# EAGLE design rev1 (EAGLE 6.5.0)
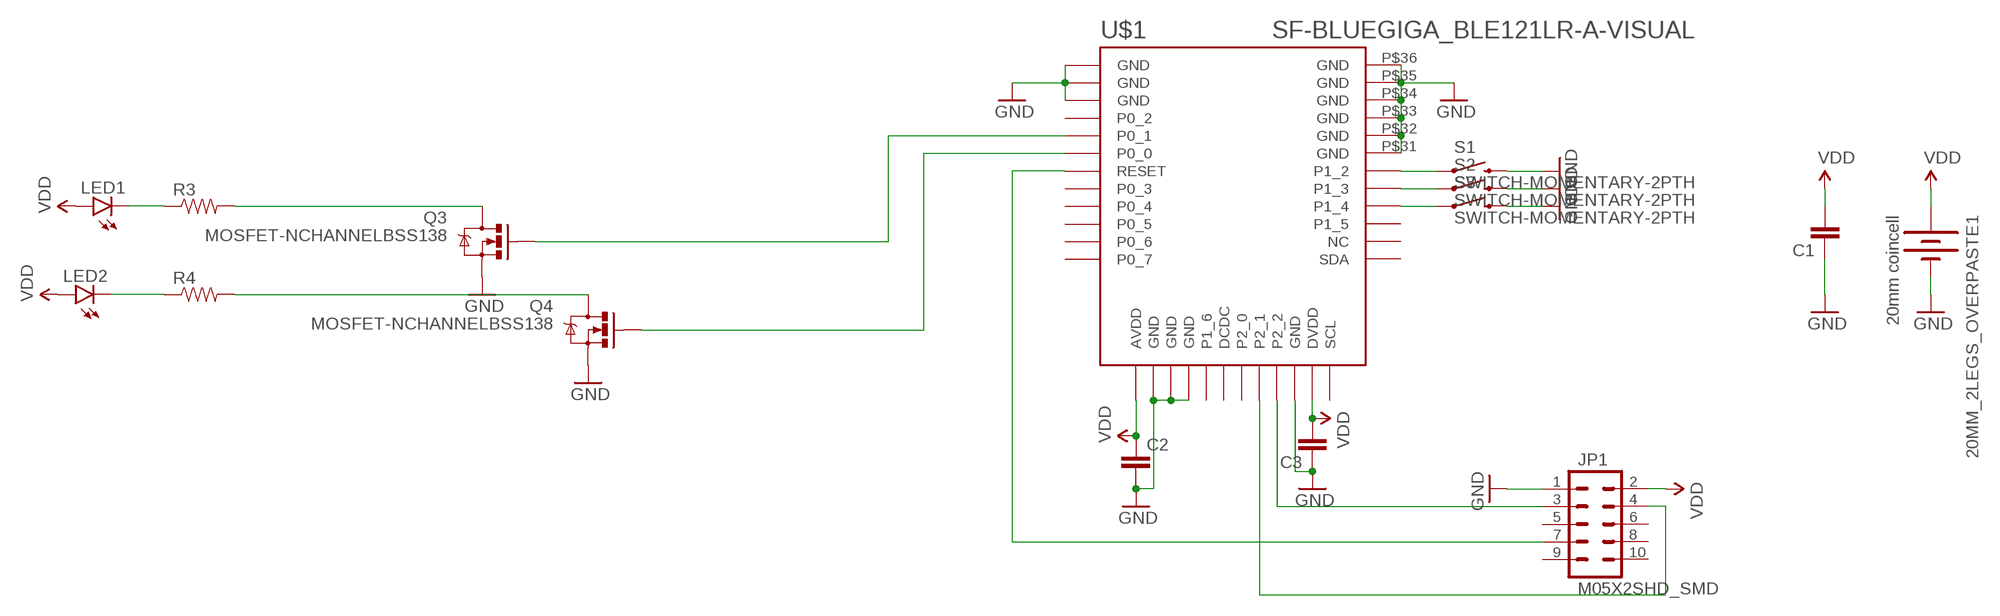
[diagram p0: schematic, sheet 1]

## Parts
20MM_2LEGS_OVERPASTE1  20mm coincell  BATTERY20MM_4LEGS  [BATTCON_20MM_4LEGS]
C1  CAP1206  [1206]
C2  CAP0603-CAP  [0603-CAP]
C3  CAP0603-CAP  [0603-CAP]
JP1  M05X2SHD_SMD  [2X5-SHROUDED_SMD]
LED1  LED1206  [LED-1206]
LED2  LED1206  [LED-1206]
Q3  MOSFET-NCHANNELBSS138  [SOT23-3]
Q4  MOSFET-NCHANNELBSS138  [SOT23-3]
R3  RESISTOR0603  [0603-RES]
R4  RESISTOR0603  [0603-RES]
S1  SWITCH-MOMENTARY-2PTH  [TACTILE-PTH]
S2  SWITCH-MOMENTARY-2PTH  [TACTILE-PTH]
S3  SWITCH-MOMENTARY-2PTH  [TACTILE-PTH]
U$1  SF-BLUEGIGA_BLE121LR-A-VISUAL  [SF-BLUEGIGA_BLE121LR-A]

## Nets
GND: 20MM_2LEGS_OVERPASTE1.2(-) C1.1 C2.2 C3.1 JP1.1 Q3.2(S) Q4.2(S) S1.3 S2.3 S3.3 U$1.P$1(GND) U$1.P$2(GND) U$1.P$3(GND) U$1.P$14(GND) U$1.P$15(GND) U$1.P$16(GND) U$1.P$22(GND) U$1.P$31(GND) U$1.P$32(GND) U$1.P$33(GND) U$1.P$34(GND) U$1.P$35(GND) U$1.P$36(GND)
N$1: Q4.1(G) U$1.P$6(P0_0)
N$3: S1.1 U$1.P$30(P1_2)
N$4: S2.1 U$1.P$29(P1_3)
N$5: S3.1 U$1.P$28(P1_4)
N$6: Q3.3(D) R3.2
N$7: Q4.3(D) R4.2
N$8: Q3.1(G) U$1.P$5(P0_1)
N$11: LED1.C R3.1
N$12: JP1.3 U$1.P$21(P2_2)
N$13: JP1.4 U$1.P$20(P2_1)
N$14: JP1.7 U$1.P$7(RESET)
N$15: LED2.C R4.1
VDD: 20MM_2LEGS_OVERPASTE1.1(+) C1.2 C2.1 C3.2 JP1.2 LED1.A LED2.A U$1.P$13(AVDD) U$1.P$23(DVDD)
Unconnected: JP1.5 JP1.6 JP1.8 JP1.9 JP1.10 U$1.P$4(P0_2) U$1.P$8(P0_3) U$1.P$9(P0_4) U$1.P$10(P0_5) U$1.P$11(P0_6) U$1.P$12(P0_7) U$1.P$17(P1_6) U$1.P$18(DCDC) U$1.P$19(P2_0) U$1.P$24(SCL) U$1.P$25(SDA) U$1.P$26(NC) U$1.P$27(P1_5)

## Library data of the parts
20MM_2LEGS_OVERPASTE1 = bluetipz:BATTERY: Battery Holders Various common sizes : AA, AAA, 20mm coin cell and 12mm coin cell. 20MM_4LEGS, BATT-10373; PROD_ID: BATT-10373
C1-C3 = SparkFun-Capacitors:CAP: Capacitor Standard 0603 ceramic capacitor, and 0.1" leaded capacitor.
JP1 = SparkFun-Connectors:M05X2: Header 5x2 Standard 10-pin dual row 0.1" header. Commonly used with AVR-ISP. Use with Spark Fun Electronics SKU: PRT-00778
LED1 LED2 = SparkFun-LED:LED: LEDs Standard schematic elements and footprints for 5mm, 3mm, 1206, and 0603 sized LEDs. 5mm - Spark Fun Electronics SKU : COM-00529 (and others)
Q3 Q4 = SparkFun-DiscreteSemi:MOSFET-NCHANNEL: Common NMOSFET Parts MFG P/N Store ID Prod ID FDD8780 TRANS-09984 SI7820DN TRANS-11055 FDS6630A IC-08089 2N7002PW TRANS-11151 FQP30N06L COM-10213 TRANS-10060 BSS123LT1G TRANS-08345 BSS138 TRANS-00830 BS170 2N7000; PROD_ID: TRANS-00830
R3 R4 = SparkFun-Resistors:RESISTOR: Resistor Basic schematic elements and footprints for 0603, 1206, and PTH resistors.
S1-S3 = SparkFun-Electromechanical:SWITCH-MOMENTARY-2: Various NO switches- pushbuttons, reed, etc
U$1 = bluetipz:SF-BLUEGIGA_BLE121LR-A-VISUAL

## Board
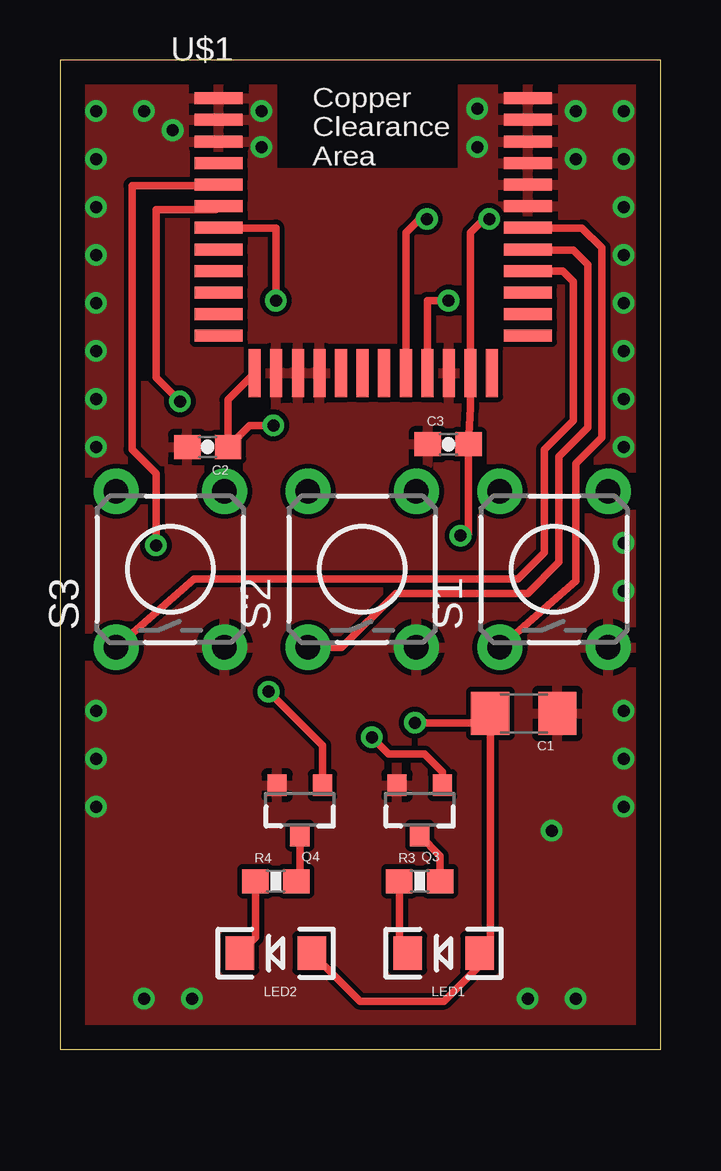
[diagram p1: board, top side]
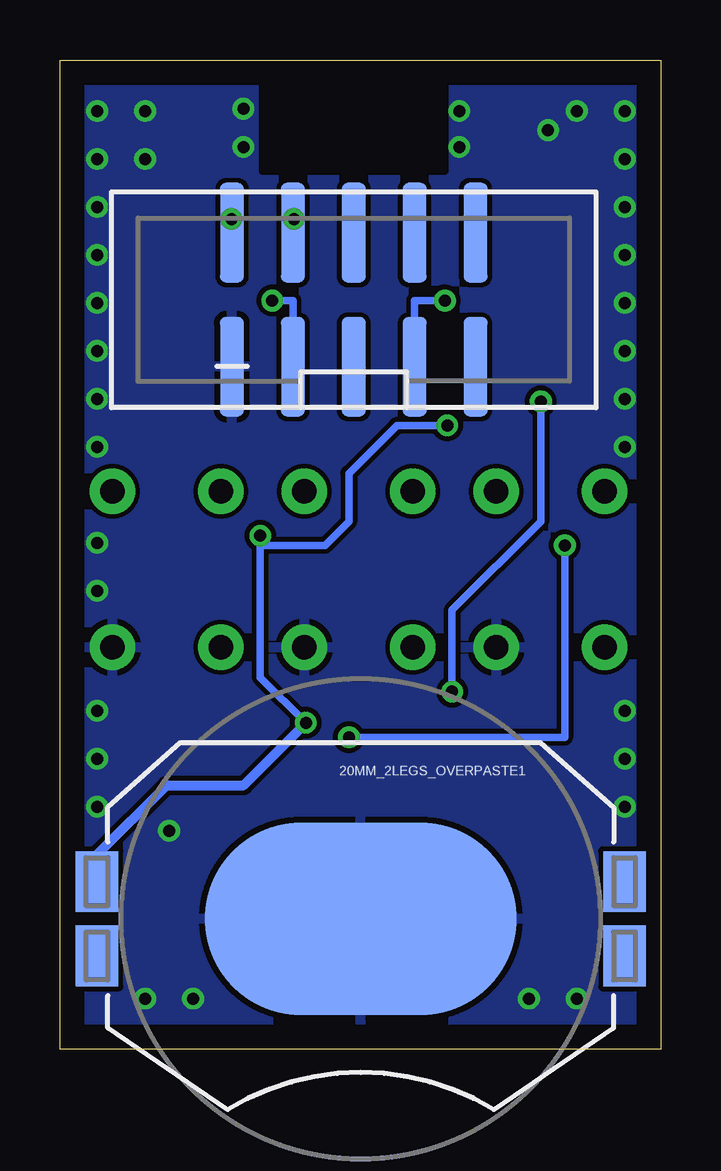
[diagram p2: board, bottom side, seen from below]

Size 25.05 x 41.23 mm. Coordinates in mm from the lower left corner, seen from the top.
Outline: 0,0 25.05,0 25.05,41.23 0,41.23 0,0
Copper layers (1*16): Top 0.035mm / dielectric 1.5mm / Bottom 0.035mm
Design rules "default": minimum track width 10mil, minimum drill 24mil, track to track 8mil, track to pad 8mil, pad to pad 8mil, via to via 8mil, smd to smd 8mil, copper to edge 40mil, drill to drill 8mil, minimum pad ring 10mil, minimum via ring 8mil, stop-mask expansion 4mil, vias tented up to drill 0mil, thermal gap 10mil

### Footprints (pad centres in the part's own frame; a part is rotated, then mirrored left to right if it is on the bottom)
BATTCON_20MM_4LEGS = smd 1.778 x 2.54: 1 -11,1.55; 3 11,1.55; P$1 -11,-1.55; P$2 11,-1.55 | smd 13 x 8: 2 0,0
1206 = smd 1.6 x 1.8: 1 -1.4,0; 2 1.4,0
0603-CAP = smd 1.1 x 1: 1 -0.85,0; 2 0.85,0
2X5-SHROUDED_SMD = smd 4.15 x 1: 1 -2.794,5.08; 2 2.794,5.08; 3 -2.794,2.54; 4 2.794,2.54; 5 -2.794,0; 6 2.794,0; 7 -2.794,-2.54; 8 2.794,-2.54; 9 -2.794,-5.08; 10 2.794,-5.08
LED-1206 = smd 1.2 x 1.4: A -1.5,0; C 1.5,0
SOT23-3 = smd 0.8 x 0.9: 1 -0.95,-1; 2 0.95,-1; 3 0,1.1
0603-RES = smd 1.1 x 1: 1 -0.85,0; 2 0.85,0
TACTILE-PTH = drill 1.016 pad 1.88: 1 -3.251,2.261; 2 3.251,2.261; 3 -3.251,-2.261; 4 3.251,-2.261
SF-BLUEGIGA_BLE121LR-A = smd 2 x 0.5: P$1 2,13.45; P$2 2,12.55; P$3 2,11.65; P$4 2,10.75; P$5 2,9.85; P$6 2,8.95; P$7 2,8.05; P$8 2,7.15; P$9 2,6.25; P$10 2,5.35; P$11 2,4.45; P$12 2,3.55; P$25 14.9,3.55; P$26 14.9,4.45; P$27 14.9,5.35; P$28 14.9,6.25; P$29 14.9,7.15; P$30 14.9,8.05; P$31 14.9,8.95; P$32 14.9,9.85; P$33 14.9,10.75; P$34 14.9,11.65; P$35 14.9,12.55; P$36 14.9,13.45 | smd 0.5 x 2: P$13 3.5,2; P$14 4.4,2; P$15 5.3,2; P$16 6.2,2; P$17 7.1,2; P$18 8,2; P$19 8.9,2; P$20 9.8,2; P$21 10.7,2; P$22 11.6,2; P$23 12.5,2; P$24 13.4,2

### Placement (x,y rotation side)
20MM_2LEGS_OVERPASTE1  12.51,5.43 0 bottom
C1  19.34,13.99 180 top
C2  6.16,25.1 180 top
C3  16.19,25.21 0 top
JP1  12.8,31.24 90 bottom
LED1  16,4 180 top
LED2  9,4 180 top
Q3  15,10 180 top
Q4  10,10 180 top
R3  15,7 0 top
R4  9,7 0 top
S1  20.6,20 90 top
S2  12.6,20 90 top
S3  4.6,20 90 top
U$1  4.62,26.18 0 top

### Tracks (layer width: path | path; a pad name or v marks a point on that pad's centre or on a via)
GND  (via drill 0.5)
  other vias: 4.7,38.3 21.5,39.1 21.5,37.1 23.5,39.1 23.5,37.1 23.5,35.1 23.5,33.1 23.5,31.1 23.5,29.1 23.5,27.1 23.5,25.1 23.5,21.1 23.5,19.1 20.5,9.1 23.5,14.1 23.5,12.1 23.5,10.1 1.5,10.1 21.5,2.1 19.5,2.1 5.5,2.1 3.5,2.1 1.5,12.1 1.5,14.1 3.5,39.1 1.5,39.1 1.5,37.1 1.5,35.1 8.4,39.1 8.4,37.6 17.4,37.6 17.4,39.2 1.5,33.1 1.5,31.1 1.5,29.1 1.5,27.1 1.5,25.1
  pour Bottom: 0,0 25,0 25,41 0,41
  pour Top: 0,0 25,0 25,41 0,41
N$1  (via drill 0.5)
  Top 0.305: U$1.P$6 6.49,35 4,35 4,28 v5,27 | v8.7,14.9 10.95,12.65 Q4.1
  Bottom 0.305: v5,27 5,22 8.7,18.3 v8.7,14.9
N$2
  cutout Bottom: 9,40 9,36.6 16.6,36.6 16.6,40.1 9,40.1
N$3
  Top 0.305: U$1.P$30 21.77,34.23 22.6,33.4 22.6,25.5 21.5,24.4 21.5,19.51 S1.1
N$4
  Top 0.305: S2.1 11.75,16.75 14,19 19.5,19 20.8,20.3 20.8,24.7 22,25.9 22,32.7 21.4,33.3 19.55,33.3 U$1.P$29
N$5
  Top 0.305: U$1.P$28 20.97,32.43 21.4,32 21.4,26.2 20.2,25 20.2,20.7 19.1,19.6 5.59,19.6 S3.1
N$6
  Top 0.305: Q3.3 15.85,8.05 R3.2
N$7
  Top 0.305: Q4.3 10,7 R4.2
N$8  (via drill 0.5)
  Top 0.305: U$1.P$5 6.59,36 3,36 3,25 4,24 v4,21 | v13,13 13.7,12.3 15.2,12.3 15.95,11.55 Q3.1
  Bottom 0.305: v4,21 4,13 v13,13
N$11
  Top 0.305: R3.1 14.15,4.35 LED1.C
N$12  (via drill 0.5)
  Top 0.305: v16.2,31.2 15.32,31.2 U$1.P$21
  Bottom 0.305: JP1.3 15.34,31.2 v16.2,31.2
N$13  (via drill 0.5)
  Top 0.305: U$1.P$20 14.42,34.03 14.99,34.6 v15.3,34.6
  Bottom 0.305: v15.3,34.6 15.34,34.56 JP1.4
  Bottom 0.61: JP1.4
N$14  (via drill 0.5)
  Top 0.305: U$1.P$7 9,34.23 v9,31.2
  Bottom 0.305: v9,31.2 10.26,31.2 JP1.7
N$15
  Top 0.305: R4.1 8.15,4.65 LED2.C
VDD  (via drill 0.5)
  Top 0.305: U$1.P$13 7.01,27.07 C2.1 7.91,26 v8.9,26 | v17.9,34.6 17.69,34.6 17.12,34.03 U$1.P$23 17.12,26.73 C3.2 17.04,21.46 v16.7,21.4 | v14.8,13.6 17.55,13.6 C1.2 17.94,4.44 LED1.A 17.5,3.5 16,2 12.5,2 LED2.A
  Bottom 0.305: v17.9,34.6 17.88,34.58 JP1.2 | v14.8,13.6 16.7,15.5 v16.7,21.4 16.7,21 14,21 13,22 13,24 11,26 v8.9,26
  Bottom 0.406: 20MM_2LEGS_OVERPASTE1.1 23.51,8.09 20.6,11 17.4,11 v14.8,13.6